# Altium schematic sheet ATmega32.SchDoc
size A4
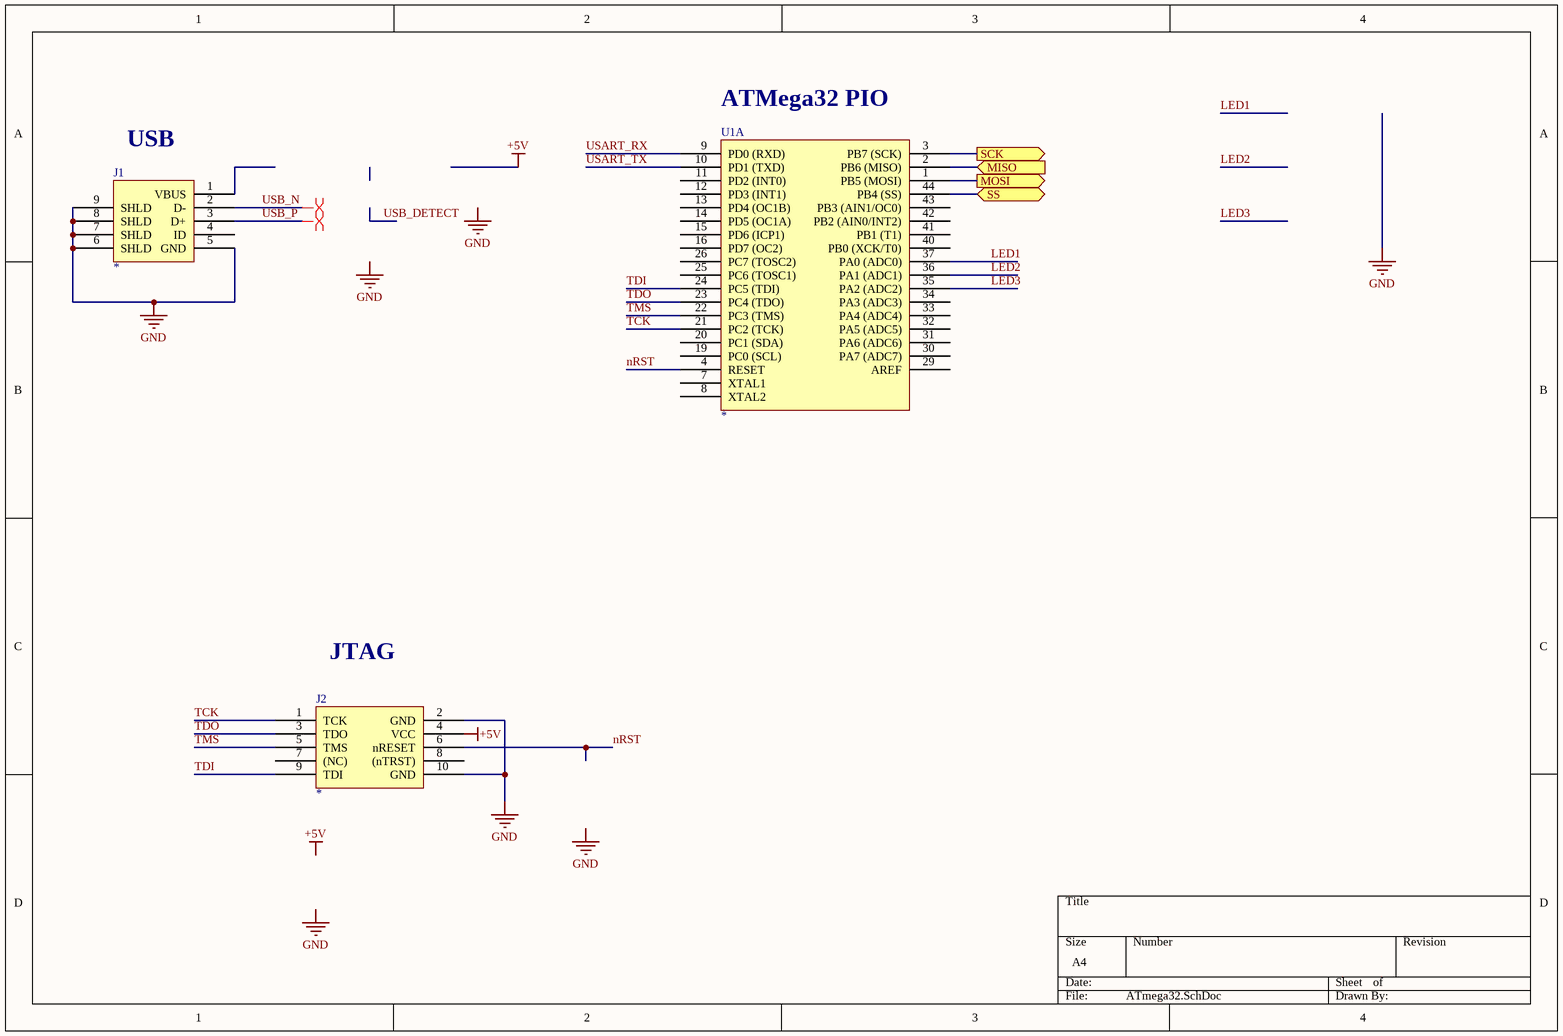
[diagram p0: ATmega32.SchDoc]

## Parts
J1  *
J2  *
U1  *  (part A of 2)

## Ports
MISO (in), MOSI (out), SCK (out), SS

## Nets
+5V: J2.4(VCC)
GND: J1.5(GND) J1.6(SHLD) J1.7(SHLD) J1.8(SHLD) J1.9(SHLD) J2.2(GND) J2.10(GND)
LED1: U1.37(PA0_(ADC0))
LED2: U1.36(PA1_(ADC1))
LED3: U1.35(PA2_(ADC2))
MISO: U1.2(PB6_(MISO)) ; port MISO
MOSI: U1.1(PB5_(MOSI)) ; port MOSI
nRST: J2.6(nRESET) U1.4(RESET)
SCK: U1.3(PB7_(SCK)) ; port SCK
SS: U1.44(PB4_(SS)) ; port SS
TCK: J2.1(TCK) U1.21(PC2_(TCK))
TDI: J2.9(TDI) U1.24(PC5_(TDI))
TDO: J2.3(TDO) U1.23(PC4_(TDO))
TMS: J2.5(TMS) U1.22(PC3_(TMS))
USART_RX: U1.9(PD0_(RXD))
USART_TX: U1.10(PD1_(TXD))
USB_N: J1.2(D-)
USB_P: J1.3(D+)

Not connected (* = marked no-connect by the designer): J1 1(VBUS) 4(ID); J2 7((NC)) 8((nTRST)); U1 7(XTAL1) 8(XTAL2) 11(PD2_(INT0)) 12(PD3_(INT1)) 13(PD4_(OC1B)) 14(PD5_(OC1A)) 15(PD6_(ICP1)) 16(PD7_(OC2)) 19(PC0_(SCL)) 20(PC1_(SDA)) 25(PC6_(TOSC1)) 26(PC7_(TOSC2)) 29(AREF) 30(PA7_(ADC7)) 31(PA6_(ADC6)) 32(PA5_(ADC5)) 33(PA4_(ADC4)) 34(PA3_(ADC3)) 40(PB0_(XCK/T0)) 41(PB1_(T1)) 42(PB2_(AIN0/INT2)) 43(PB3_(AIN1/OC0))

## Layout directives
differential pair: USB_N, USB_P

## Notes on the sheet
- (near U1) ATMega32 PIO
- (near J1) USB
- JTAG
- Labels drawn without touching a wire or pin: +5V, GND

## Library data of the parts
J1 = USB MICRO B
J2 = JTAG Header
U1 = ATmega32